# EAGLE design EMGPreamp (EAGLE 6.6.0)
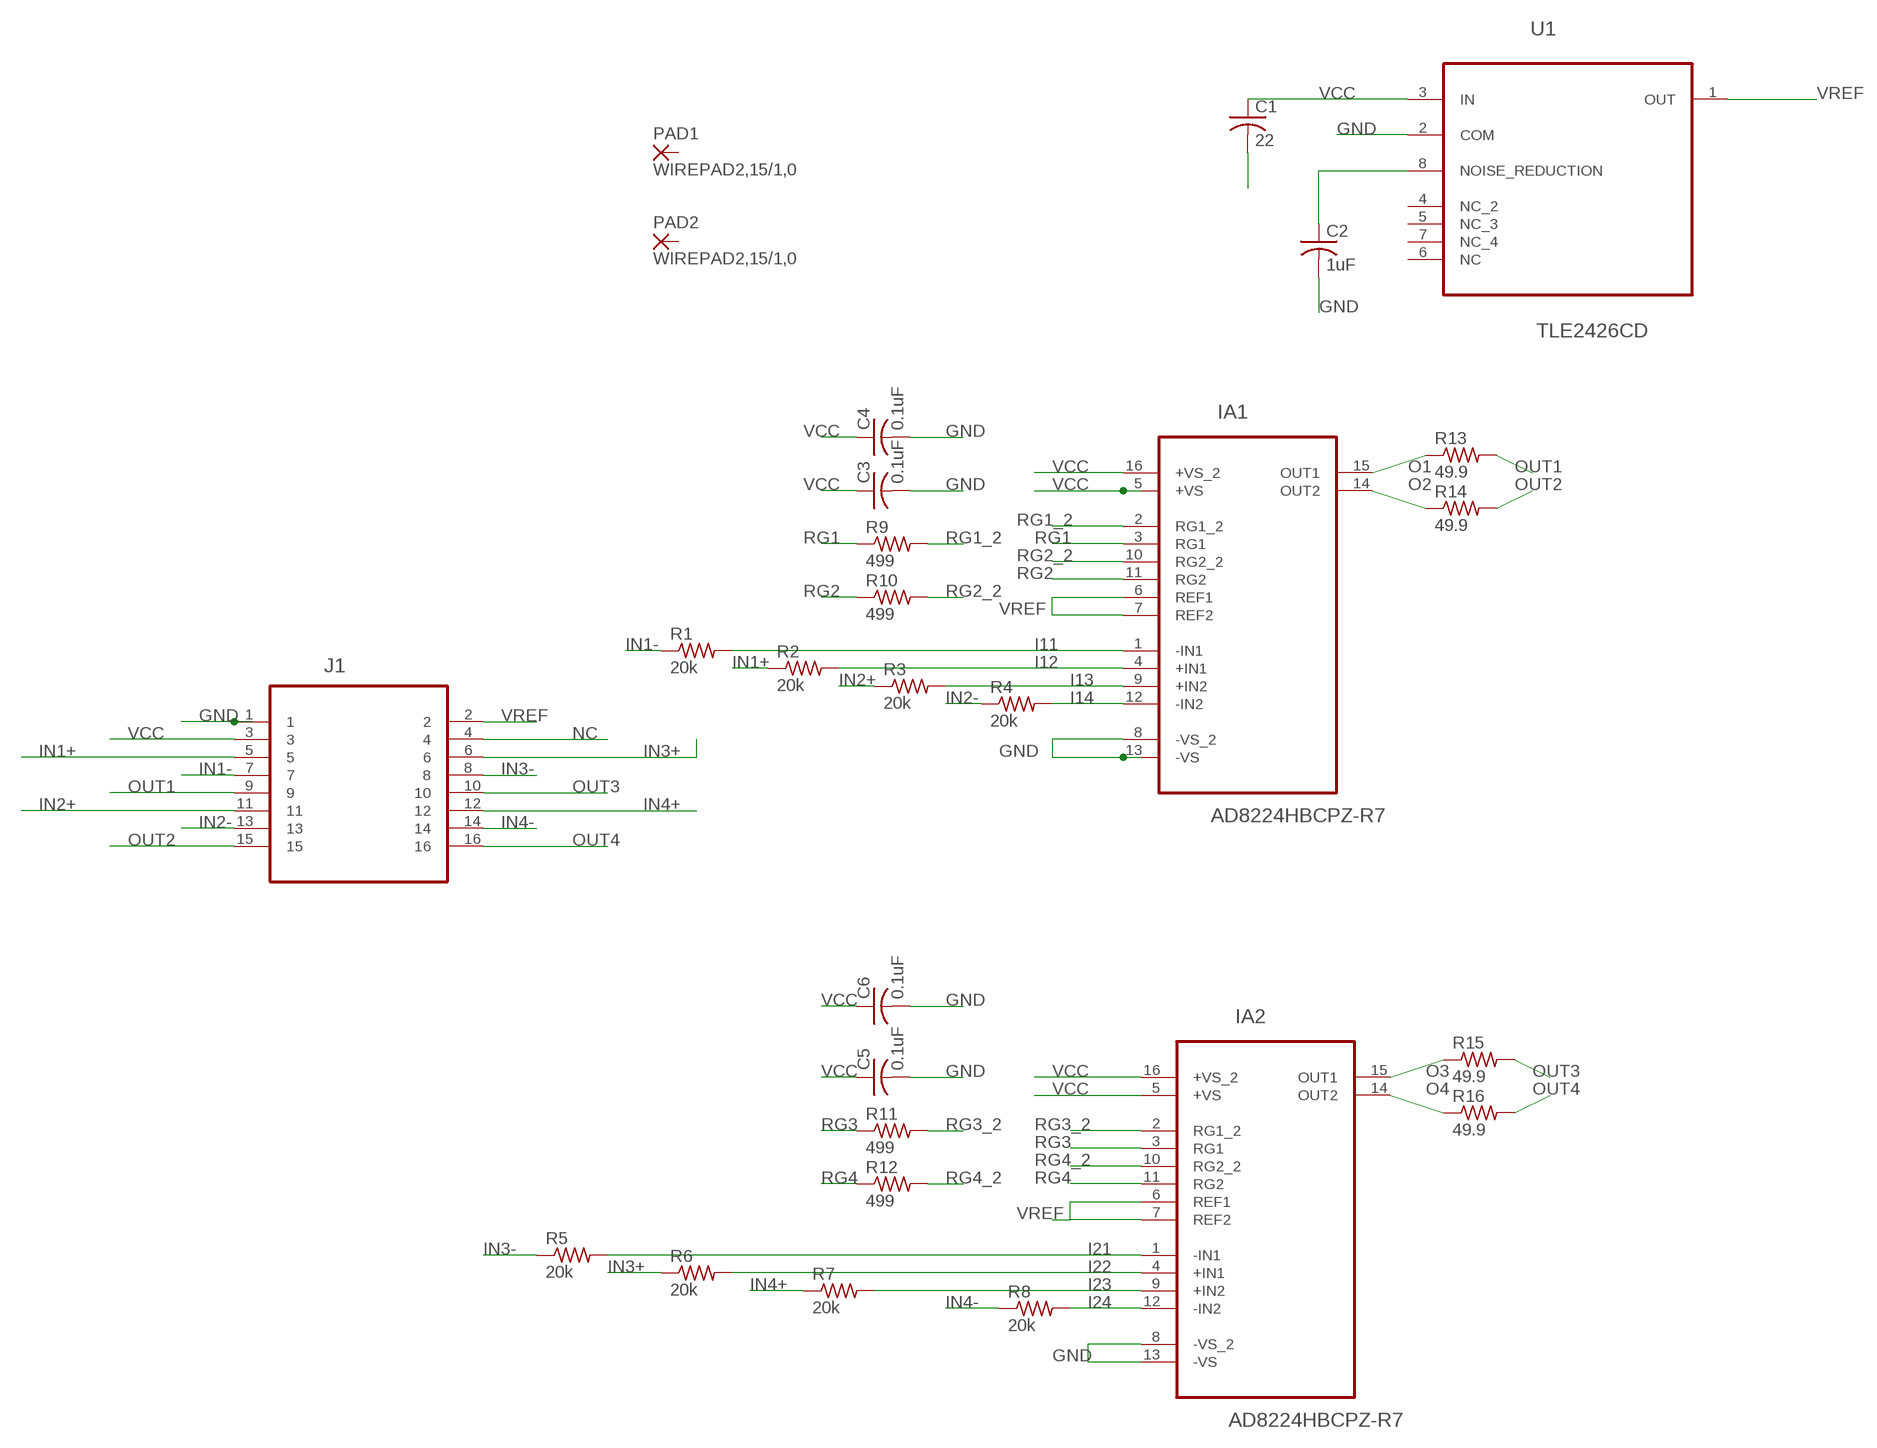
[diagram p0: schematic, sheet 1]

## Parts
C1  22  C-USC0805  [C0805]
C2  1uF  C-USC0805  [C0805]
C3  0.1uF  C-USC0805  [C0805]
C4  0.1uF  C-USC0805  [C0805]
C5  0.1uF  C-USC0805  [C0805]
C6  0.1uF  C-USC0805  [C0805]
IA1  AD8224HBCPZ-R7  [QFN65P400X400X100-16N]
IA2  AD8224HBCPZ-R7  [QFN65P400X400X100-16N]
J1  FTSH-108-01-L-MT  [FTSH-108-1-L-MT]
PAD1  WIREPAD2,15/1,0  [2,15/1,0]
PAD2  WIREPAD2,15/1,0  [2,15/1,0]
R1  20k  R-US_R0805  [R0805]
R2  20k  R-US_R0805  [R0805]
R3  20k  R-US_R0805  [R0805]
R4  20k  R-US_R0805  [R0805]
R5  20k  R-US_R0805  [R0805]
R6  20k  R-US_R0805  [R0805]
R7  20k  R-US_R0805  [R0805]
R8  20k  R-US_R0805  [R0805]
R9  499  R-US_R0805  [R0805]
R10  499  R-US_R0805  [R0805]
R11  499  R-US_R0805  [R0805]
R12  499  R-US_R0805  [R0805]
R13  49.9  R-US_R0805  [R0805]
R14  49.9  R-US_R0805  [R0805]
R15  49.9  R-US_R0805  [R0805]
R16  49.9  R-US_R0805  [R0805]
U1  TLE2426CD  [SOIC127P600X175-8N]

## Nets
GND: C1.2 C2.2 C3.2 C4.2 C5.2 C6.2 IA1.8(-VS_2) IA1.13(-VS) IA2.8(-VS_2) IA2.13(-VS) J1.1 U1.2(COM)
I11: IA1.1(-IN1) R1.2
I12: IA1.4(+IN1) R2.2
I13: IA1.9(+IN2) R3.2
I14: IA1.12(-IN2) R4.2
I21: IA2.1(-IN1) R5.2
I22: IA2.4(+IN1) R6.2
I23: IA2.9(+IN2) R7.2
I24: IA2.12(-IN2) R8.2
IN1+: J1.5 R2.1
IN1-: J1.7 R1.1
IN2+: J1.11 R3.1
IN2-: J1.13 R4.1
IN3+: J1.6 R6.1
IN3-: J1.8 R5.1
IN4+: J1.12 R7.1
IN4-: J1.14 R8.1
N$1: C2.1 U1.8(NOISE_REDUCTION)
NC: J1.4
O1: IA1.15(OUT1) R13.1
O2: IA1.14(OUT2) R14.1
O3: IA2.15(OUT1) R15.1
O4: IA2.14(OUT2) R16.1
OUT1: J1.9 R13.2
OUT2: J1.15 R14.2
OUT3: J1.10 R15.2
OUT4: J1.16 R16.2
RG1: IA1.3(RG1) R9.1
RG1_2: IA1.2(RG1_2) R9.2
RG2: IA1.11(RG2) R10.1
RG2_2: IA1.10(RG2_2) R10.2
RG3: IA2.3(RG1) R11.1
RG3_2: IA2.2(RG1_2) R11.2
RG4: IA2.11(RG2) R12.1
RG4_2: IA2.10(RG2_2) R12.2
VCC: C1.1 C3.1 C4.1 C5.1 C6.1 IA1.5(+VS) IA1.16(+VS_2) IA2.5(+VS) IA2.16(+VS_2) J1.3 U1.3(IN)
VREF: IA1.6(REF1) IA1.7(REF2) IA2.6(REF1) IA2.7(REF2) J1.2 U1.1(OUT)
Unconnected: PAD1.1(P) PAD2.1(P) U1.4(NC_2) U1.5(NC_3) U1.6(NC) U1.7(NC_4)

## Library data of the parts
C1-C6 = rcl:C-US: CAPACITOR, American symbol
IA1 IA2 = Analog Devices_By_element14_Batch1:AD8224HBCPZ-R7: Precision, Dual-Channel, JFET Input,Rail-to-Rail Instrumentation Amplifier; MPN: AD8224HBCPZ-R7; OC_FARNELL: -; OC_NEWARK: 79R2339; PACKAGE: QFN-16; SUPPLIER: Analog Devices
J1 = tuckerLib:FTSH-108-01-L-MT
PAD1 PAD2 = wirepad:WIREPAD: Wire PAD connect wire on PCB
R1-R16 = rcl:R-US_: RESISTOR, American symbol
U1 = Texas Instruments_By_element14_Batch_1:TLE2426CD: PRECISION VIRTUAL GROUND; MPN: TLE2426CD; OC_FARNELL: 8454809; OC_NEWARK: 50B7917; PACKAGE: SOIC-8; SUPPLIER: Texas Instruments

## Board
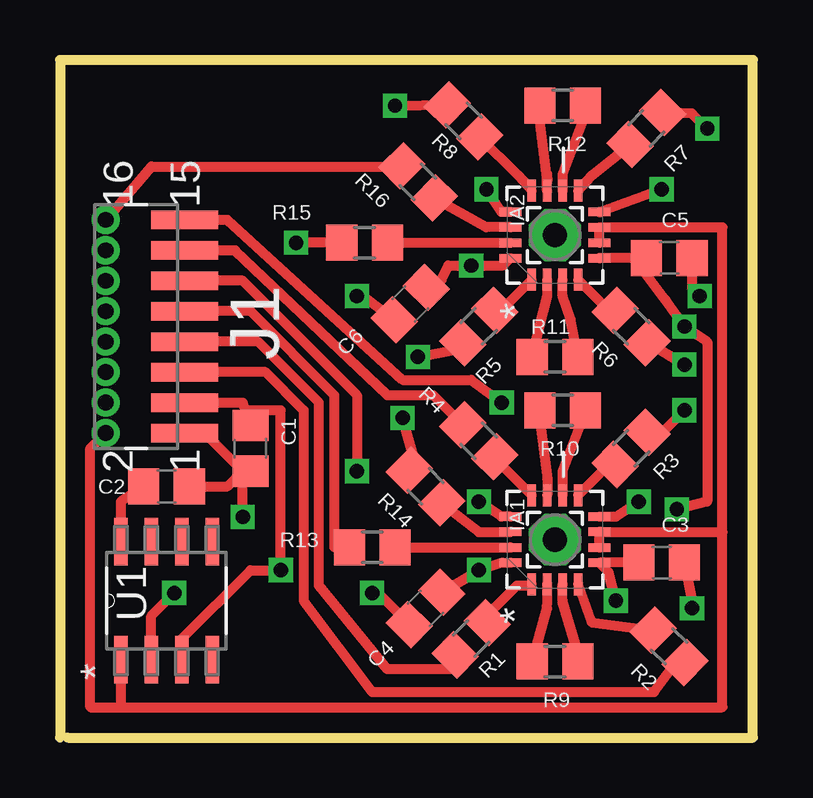
[diagram p1: board, top side]
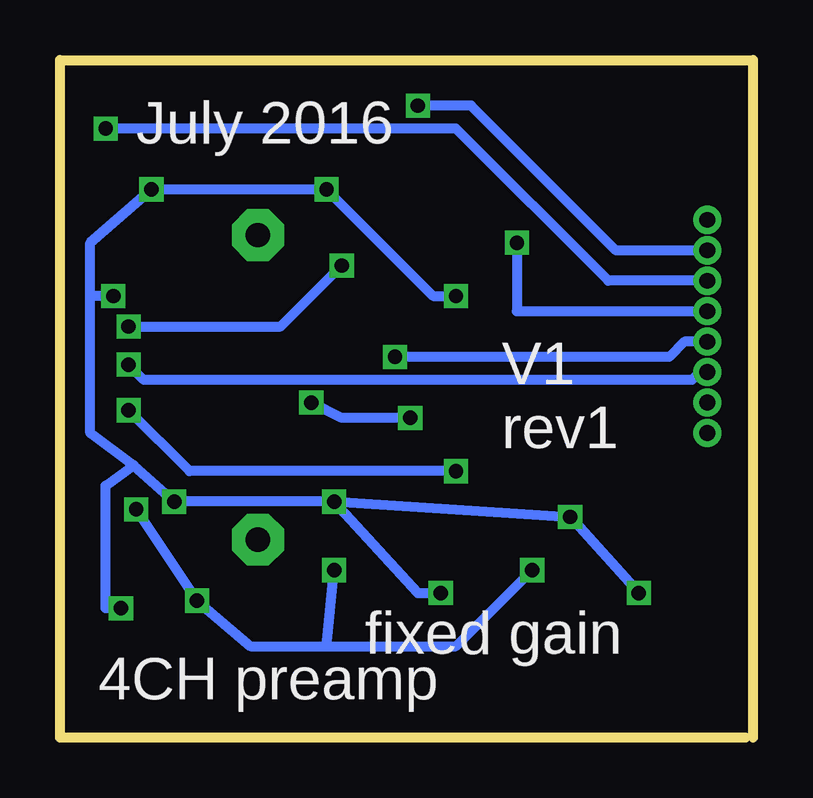
[diagram p2: board, bottom side, seen from below]

Size 28.89 x 28.26 mm. Coordinates in mm from the lower left corner, seen from the top.
Outline: 0.32,0 28.89,0 28.89,28.26 0,28.26 0,0
Copper layers (1*16): Top 0.035mm / dielectric 1.5mm / Bottom 0.035mm
Design rules "default *": minimum track width 10mil, minimum drill 20mil, track to track 8mil, track to pad 8mil, pad to pad 8mil, via to via 8mil, smd to smd 8mil, copper to edge 40mil, drill to drill 8mil, minimum pad ring 10mil, minimum via ring 8mil, stop-mask expansion 4mil, vias tented up to drill 0mil, thermal gap 10mil

### Footprints (pad centres in the part's own frame; a part is rotated, then mirrored left to right if it is on the bottom)
C0805 = smd 1.3 x 1.5: 1 -0.95,0; 2 0.95,0
QFN65P400X400X100-16N = smd 0.914 x 0.356: 1 -1.854,0.965; 2 -1.854,0.33; 3 -1.854,-0.33; 4 -1.854,-0.965; 9 1.854,-0.965; 10 1.854,-0.33; 11 1.854,0.33; 12 1.854,0.965 | smd 0.356 x 0.914: 5 -0.965,-1.854; 6 -0.33,-1.854; 7 0.33,-1.854; 8 0.965,-1.854; 13 0.965,1.854; 14 0.33,1.854; 15 -0.33,1.854; 16 -0.965,1.854
FTSH-108-1-L-MT = smd 0.762 x 2.794: 1 -4.445,-2.032; 3 -3.175,-2.032; 5 -1.905,-2.032; 7 -0.635,-2.032; 9 0.635,-2.032; 11 1.905,-2.032; 13 3.175,-2.032; 15 4.445,-2.032 | drill 0.66: 2 -4.445,1.27; 4 -3.175,1.27; 6 -1.905,1.27; 8 -0.635,1.27; 10 0.635,1.27; 12 1.905,1.27; 14 3.175,1.27; 16 4.445,1.27
2,15/1,0 = drill 1.016 pad 2.159 octagon: 1 0,0
R0805 = smd 1.3 x 1.5: 1 -0.95,0; 2 0.95,0
SOIC127P600X175-8N = smd 1.981 x 0.559: 1 -2.464,1.905; 2 -2.464,0.635; 3 -2.464,-0.635; 4 -2.464,-1.905; 5 2.464,-1.905; 6 2.464,-0.635; 7 2.464,0.635; 8 2.464,1.905

### Placement (x,y rotation side)
C1  7.94,12.06 270 top
C2  4.45,10.48 0 top
C3  25.08,7.3 0 top
C4  15.24,5.4 225 top
C5  25.4,20 0 top
C6  14.61,18.1 225 top
IA1  20.64,8.26 90 top
IA2  20.64,20.95 90 top
J1  3.18,17.14 90 top
PAD1  20.64,20.95 0 top
PAD2  20.64,8.26 0 top
R1  17.14,4.13 45 top
R2  25.4,3.81 135 top
R3  23.81,12.06 225 top
R4  17.46,12.38 315 top
R5  17.46,17.14 45 top
R6  23.81,17.14 135 top
R7  24.45,25.4 225 top
R8  16.83,25.72 315 top
R9  20.64,3.17 180 top
R10  20.96,13.65 0 top
R11  20.64,15.88 180 top
R12  20.96,26.35 0 top
R13  13.02,7.94 180 top
R14  15.24,10.48 135 top
R15  12.7,20.64 180 top
R16  14.92,23.18 135 top
U1  4.45,5.71 90 top

### Tracks (layer width: path | path; a pad name or v marks a point on that pad's centre or on a via)
GND  (via drill 0.6)
  Top 0.406: J1.1 6.03,12.7 7.62,11.11 | 7.62,11.11 8.25,11.11 C1.2 7.62,11.43 7.62,11.11 | C2.2 6.98,10.48 7.62,11.11 | IA2.13 18.4,21.92 v17.78,22.86 | v25.08,22.86 22.5,21.91 IA2.8 | IA1.8 23.19,9.22 v24.13,9.84 | v7.62,9.21 7.62,11.11 | IA1.13 18.4,9.22 v17.46,9.84 | U1.2 3.81,5.08 v4.76,6.03 | C3.2 26.35,5.72 v26.35,5.4 | C5.2 26.35,18.73 v26.67,18.41 | v12.38,18.41 12.63,18.41 C6.2 | v13.02,6.03 13.26,6.03 C4.2
  Bottom 0.406: 25.81,11.36 v24.13,9.84 v17.46,9.84 | 25.81,11.36 27.62,12.7 27.62,18.41 | 27.62,18.41 27.62,20.64 v25.08,22.86 v17.78,22.86 13.34,18.41 v12.38,18.41 | v4.76,6.03 v7.62,9.21 v17.46,9.84 | v26.35,5.4 26.99,5.4 26.99,10.5 25.81,11.36 | v26.67,18.41 27.62,18.41 | v17.46,9.84 13.97,6.03 v13.02,6.03
I11
  Top 0.406: R1.2 18.11,5.41 19.05,6.35 19.62,6.35 IA1.1
I12
  Top 0.406: IA1.4 22.16,4.81 R2.2
I13
  Top 0.406: R3.2 22.86,11.11 22.61,11.11 IA1.9
I14
  Top 0.406: R4.2 18.49,11.29 IA1.12
I21
  Top 0.406: R5.2 18.49,17.92 IA2.1
I22
  Top 0.406: R6.2 22.78,17.92 IA2.4
I23
  Top 0.406: IA2.9 22.16,23.44 R7.2
I24
  Top 0.406: IA2.12 19.12,23.44 R8.2
IN1+
  Top 0.406: R2.1 25.72,3.16 25.72,3.17 24.76,1.91 13.02,1.91 10.16,5.71 10.16,13.65 8.57,15.24 J1.5
IN1-
  Top 0.406: R1.1 16.51,2.86 13.65,2.86 10.79,6.35 10.79,13.97 8.26,16.51 J1.7
IN2+  (via drill 0.6)
  Top 0.406: v12.38,11.11 12.38,14.29 7.62,19.05 J1.11 | R3.1 24.59,12.21 v26.03,13.65
  Bottom 0.406: v12.38,11.11 23.5,11.11 v26.03,13.65
IN2-
  Top 0.406: 16.51,13.34 R4.1 15.56,14.29 13.65,14.29 7.3,20.32 J1.13
IN3+  (via drill 0.6)
  Top 0.406: R6.1 24.46,16.52 v26.03,15.56
  Bottom 0.406: J1.6 2.22,15.24 2.54,14.92 25.4,14.92 v26.03,15.56
IN3-  (via drill 0.6)
  Top 0.406: v14.92,15.88 16.51,16.19 R5.1
  Bottom 0.406: v14.92,15.88 3.49,15.88 2.86,16.51 J1.8
IN4+  (via drill 0.6)
  Top 0.406: v26.99,25.4 26.35,26.02 R7.1
  Bottom 0.406: v26.99,25.4 12.38,25.4 6.03,19.05 J1.12
IN4-  (via drill 0.6)
  Top 0.406: v13.97,26.35 R8.1
  Bottom 0.406: v13.97,26.35 11.75,26.35 5.72,20.32 J1.14
N$1
  Top 0.406: C2.1 2.54,9.84 U1.8
O1
  Top 0.406: R13.1 18.77,7.94 IA1.15
O2
  Top 0.406: R14.1 16.02,9.7 17.46,8.57 18.77,8.57 IA1.14
O3
  Top 0.406: R15.1 18.77,20.64 IA2.15
O4
  Top 0.406: IA2.14 17.77,21.29 R16.1
OUT1
  Top 0.406: R13.2 11.43,7.94 11.43,14.29 7.94,17.78 J1.9
OUT2  (via drill 0.6)
  Top 0.406: J1.15 6.98,21.59 14.29,14.92 17.14,14.92 v18.41,13.97 | R14.2 14.78,11.57 v14.29,13.34
  Bottom 0.406: v14.29,13.34 17.14,13.34 v18.41,13.97
OUT3  (via drill 0.6)
  Top 0.406: 11.42,20.62 v9.84,20.64 R15.2
  Bottom 0.406: v9.84,20.64 9.84,17.78 J1.10
OUT4
  Top 0.406: J1.16 3.81,23.81 14.21,23.81 R16.2
RG1
  Top 0.406: R9.1 21.6,3.48 20.96,5.71 20.96,6.39 IA1.3
RG1_2
  Top 0.406: R9.2 20.3,5.38 20.32,5.71 20.32,6.39 IA1.2
RG2
  Top 0.406: R10.1 19.99,13.35 20.32,10.79 20.32,10.12 IA1.11
RG2_2
  Top 0.406: R10.2 21.92,13.67 20.96,11.11 20.96,10.12 IA1.10
RG3
  Top 0.406: R11.1 21.29,17.45 20.96,18.41 20.96,19.09 IA2.3
RG3_2
  Top 0.406: R11.2 19.99,17.13 20.32,18.41 20.32,19.09 IA2.2
RG4
  Top 0.406: IA2.11 20.31,23.51 20.32,23.18 20,25.7 R12.1
RG4_2
  Top 0.406: R12.2 21.92,26.05 20.96,23.5 20.96,22.82 IA2.10
VCC  (via drill 0.6)
  Top 0.406: J1.3 7.62,13.97 C1.1 7.94,13.65 9.21,13.65 v9.21,6.99 7.94,6.99 5.08,4.13 U1.3 | v25.72,9.53 26.99,9.84 26.99,16.51 v26.03,17.14 25.24,18.26 24.29,19.53 24.45,19.37 C5.1 22.5,20 IA2.5 | C4.1 v17.46,6.99 18.45,7.3 IA1.16 | v23.18,5.71 22.86,6.92 IA1.5 22.5,7.3 C3.1 | C6.1 15.91,19.09 16.19,19.68 v17.14,19.68 18.48,19.68 IA2.16
  Bottom 0.406: v25.72,9.53 v23.18,5.71 20.96,3.81 17.78,3.81 | 17.78,3.81 12.38,3.81 v9.21,6.99 | 17.78,3.81 v17.46,6.99 | v26.03,17.14 19.69,17.14 v17.14,19.68
VREF
  Top 0.406: IA1.6 IA1.7 | 2.54,1.27 1.27,1.27 1.27,12.06 J1.2 | U1.1 2.54,1.27 | 2.54,1.27 27.62,1.27 27.62,8.57 | IA1.7 22.5,8.57 27.62,8.57 | IA1.7 22.56,8.59 | 27.62,8.57 27.62,21.27 22.5,21.27 IA2.7 IA2.6 22.5,20.64

### Text on the board
bNames: July 2016 | V1 / rev1 | fixed gain | 4CH preamp